# Altium schematic sheet LSM6DS3.SchDoc: =GlobalProjectName
size A4; ApprovedBy: Утвердил; CheckedBy: Проверил; Author: Разработал; SheetNumber: 5; SheetTotal: 11; PageSetup: Record=PageOptions|CenterHorizontal=True|CenterVertical=True|PrintScale=1.00|XCorrection=1.00|YCorrection=1.00|PrintKind=1|BorderSize=5000000|LeftOffset=0|BottomOffset=0|Orientation=2|PaperLength=1000|PaperWidth=1000|Scale=100|PaperSource=15|PrintQuality=1200|MediaType=1|DitherType=10|PaperKind=A3|PrintScaleMode=1; Weight: -; ScaleFactor: -; NormInspection: Норм.Контр.
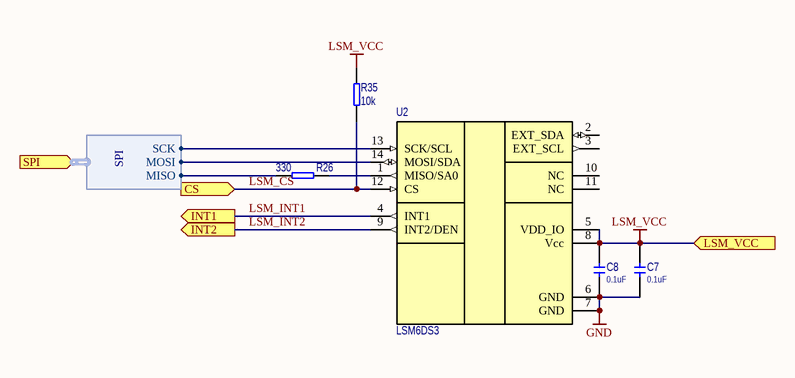
[diagram p0: LSM6DS3.SchDoc]

## Parts
C7  value 0.1uF  [CERCAP 0603]
C8  value 0.1uF  [CERCAP 0603]
R26  value 330  [RES 0603]
R35  value 10k  [RES 0603]
U2  LSM6DS3  [LGA14_LSM6DS3]

## Ports
CS (in), INT1 (out), INT2 (out), LSM_VCC (in), SPI (in, harness SPI)

## Harnesses
SPI: SCK, MOSI, MISO

## Nets
GND: C7.1 C8.1 U2.6(GND) U2.7(GND)
LSM_VCC: C7.2 C8.2 R35.2 U2.5(VDD_IO) U2.8(Vcc) ; port LSM_VCC
LSM_CS: R35.1 U2.12(CS) ; port CS
LSM_INT1: U2.4(INT1) ; port INT1
LSM_INT2: U2.9(INT2/DEN) ; port INT2
NetR26_1: R26.1 ; port SPI.MISO
NetR26_2: R26.2 U2.1(MISO/SA0)
NetU2_13: U2.13(SCK/SCL) ; port SPI.SCK
NetU2_14: U2.14(MOSI/SDA) ; port SPI.MOSI

Not connected (* = marked no-connect by the designer): U2 2(EXT_SDA) 3(EXT_SCL) 10(NC) 11(NC)

## Notes on the sheet
- Title
- Size:
- Date:
- A4
- Number:
- Time:
- Revision:
- Sheet
- of
- File:

## Library data of the parts
C7 C8 = !Capacitor: Capacitor; IsSMT: NoSMT; Diel: X7R; Voltage: *
R26 R35 = !Resistor: Resistor; IsSMT: NoSMT
U2 = LSM6DS3: Acc/Gyro; IsSMT: NoSMT